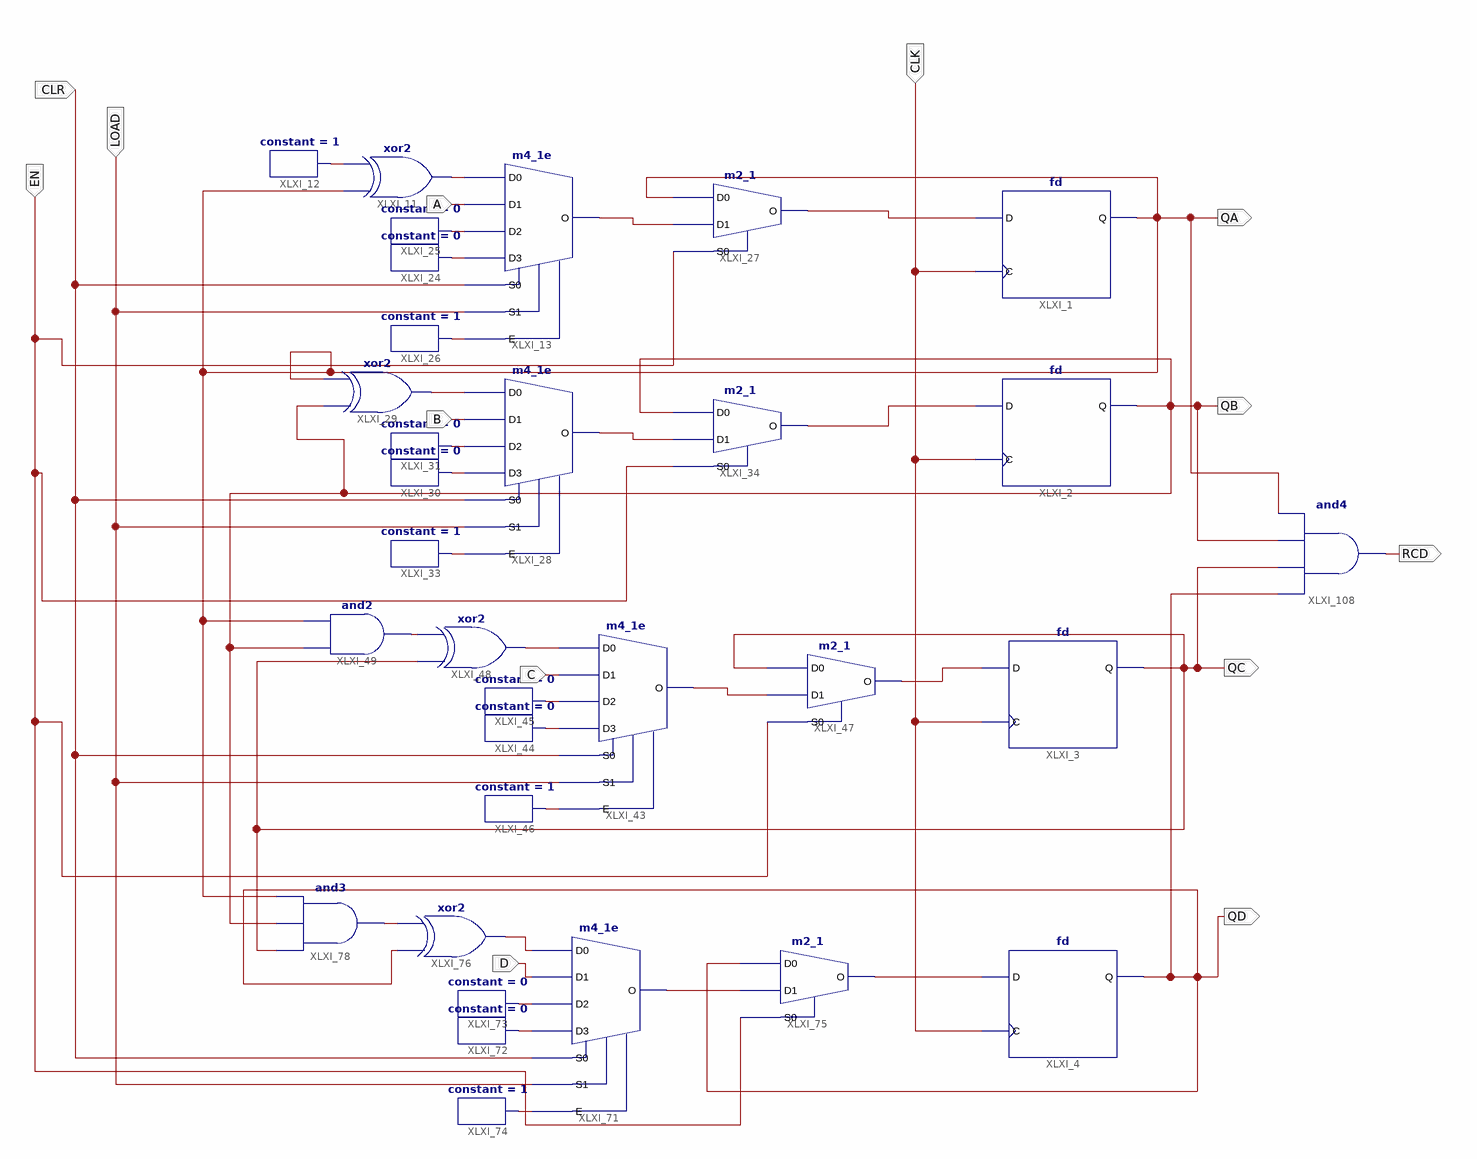
[diagram p0: schematic sheet 1]
// Xilinx ISE schematic counter163.sch (spartan3e) as structural Verilog: 32 symbols, 13 ports
module counter163 (
  input  CLK,
  input  A,
  input  CLR,
  input  LOAD,
  input  EN,
  input  B,
  input  C,
  input  D,
  output QA,
  output QB,
  output QD,
  output QC,
  output RCD
);

  wire XLXN_8, XLXN_21, XLXN_23, XLXN_24, XLXN_28, XLXN_34, XLXN_36, XLXN_39, XLXN_40, XLXN_41, XLXN_42,
       XLXN_43, XLXN_47, XLXN_67, XLXN_68, XLXN_69, XLXN_70, XLXN_71, XLXN_97, XLXN_101, XLXN_102, XLXN_103,
       XLXN_104, XLXN_105, XLXN_107, XLXN_224, XLXN_225;

  fd XLXI_1 (.C(CLK), .D(XLXN_36), .Q(QA));
  fd XLXI_2 (.C(CLK), .D(XLXN_47), .Q(QB));
  xor XLXI_11 (XLXN_21, QA, XLXN_8);
  constant #(.CValue("1")) XLXI_12 (.O(XLXN_8));
  m4_1e XLXI_13 (.D0(XLXN_21), .D1(A), .D2(XLXN_24), .D3(XLXN_23), .E(XLXN_28), .S0(CLR), .S1(LOAD), .O(XLXN_34));
  constant #(.CValue("0")) XLXI_24 (.O(XLXN_23));
  constant #(.CValue("0")) XLXI_25 (.O(XLXN_24));
  constant #(.CValue("1")) XLXI_26 (.O(XLXN_28));
  m2_1 XLXI_27 (.D0(QA), .D1(XLXN_34), .S0(EN), .O(XLXN_36));
  m4_1e XLXI_28 (.D0(XLXN_39), .D1(B), .D2(XLXN_41), .D3(XLXN_40), .E(XLXN_42), .S0(CLR), .S1(LOAD), .O(XLXN_43));
  xor XLXI_29 (XLXN_39, QB, QA);
  constant #(.CValue("0")) XLXI_30 (.O(XLXN_40));
  constant #(.CValue("0")) XLXI_31 (.O(XLXN_41));
  constant #(.CValue("1")) XLXI_33 (.O(XLXN_42));
  m2_1 XLXI_34 (.D0(QB), .D1(XLXN_43), .S0(EN), .O(XLXN_47));
  fd XLXI_4 (.C(CLK), .D(XLXN_107), .Q(QD));
  fd XLXI_3 (.C(CLK), .D(XLXN_97), .Q(QC));
  m4_1e XLXI_43 (.D0(XLXN_67), .D1(C), .D2(XLXN_69), .D3(XLXN_68), .E(XLXN_70), .S0(CLR), .S1(LOAD), .O(XLXN_71));
  constant #(.CValue("0")) XLXI_44 (.O(XLXN_68));
  constant #(.CValue("0")) XLXI_45 (.O(XLXN_69));
  constant #(.CValue("1")) XLXI_46 (.O(XLXN_70));
  m2_1 XLXI_47 (.D0(QC), .D1(XLXN_71), .S0(EN), .O(XLXN_97));
  xor XLXI_48 (XLXN_67, QC, XLXN_225);
  and XLXI_49 (XLXN_225, QB, QA);
  and XLXI_78 (XLXN_224, QC, QB, QA);
  m2_1 XLXI_75 (.D0(QD), .D1(XLXN_105), .S0(EN), .O(XLXN_107));
  m4_1e XLXI_71 (.D0(XLXN_101), .D1(D), .D2(XLXN_103), .D3(XLXN_102), .E(XLXN_104), .S0(CLR), .S1(LOAD), .O(XLXN_105));
  xor XLXI_76 (XLXN_101, QD, XLXN_224);
  constant #(.CValue("1")) XLXI_74 (.O(XLXN_104));
  constant #(.CValue("0")) XLXI_72 (.O(XLXN_102));
  constant #(.CValue("0")) XLXI_73 (.O(XLXN_103));
  and XLXI_108 (RCD, QD, QC, QB, QA);
endmodule
